# Altium schematic sheet MainBOB (RUDR).SchDoc
size C; SheetNumber: 1; SheetTotal: 3
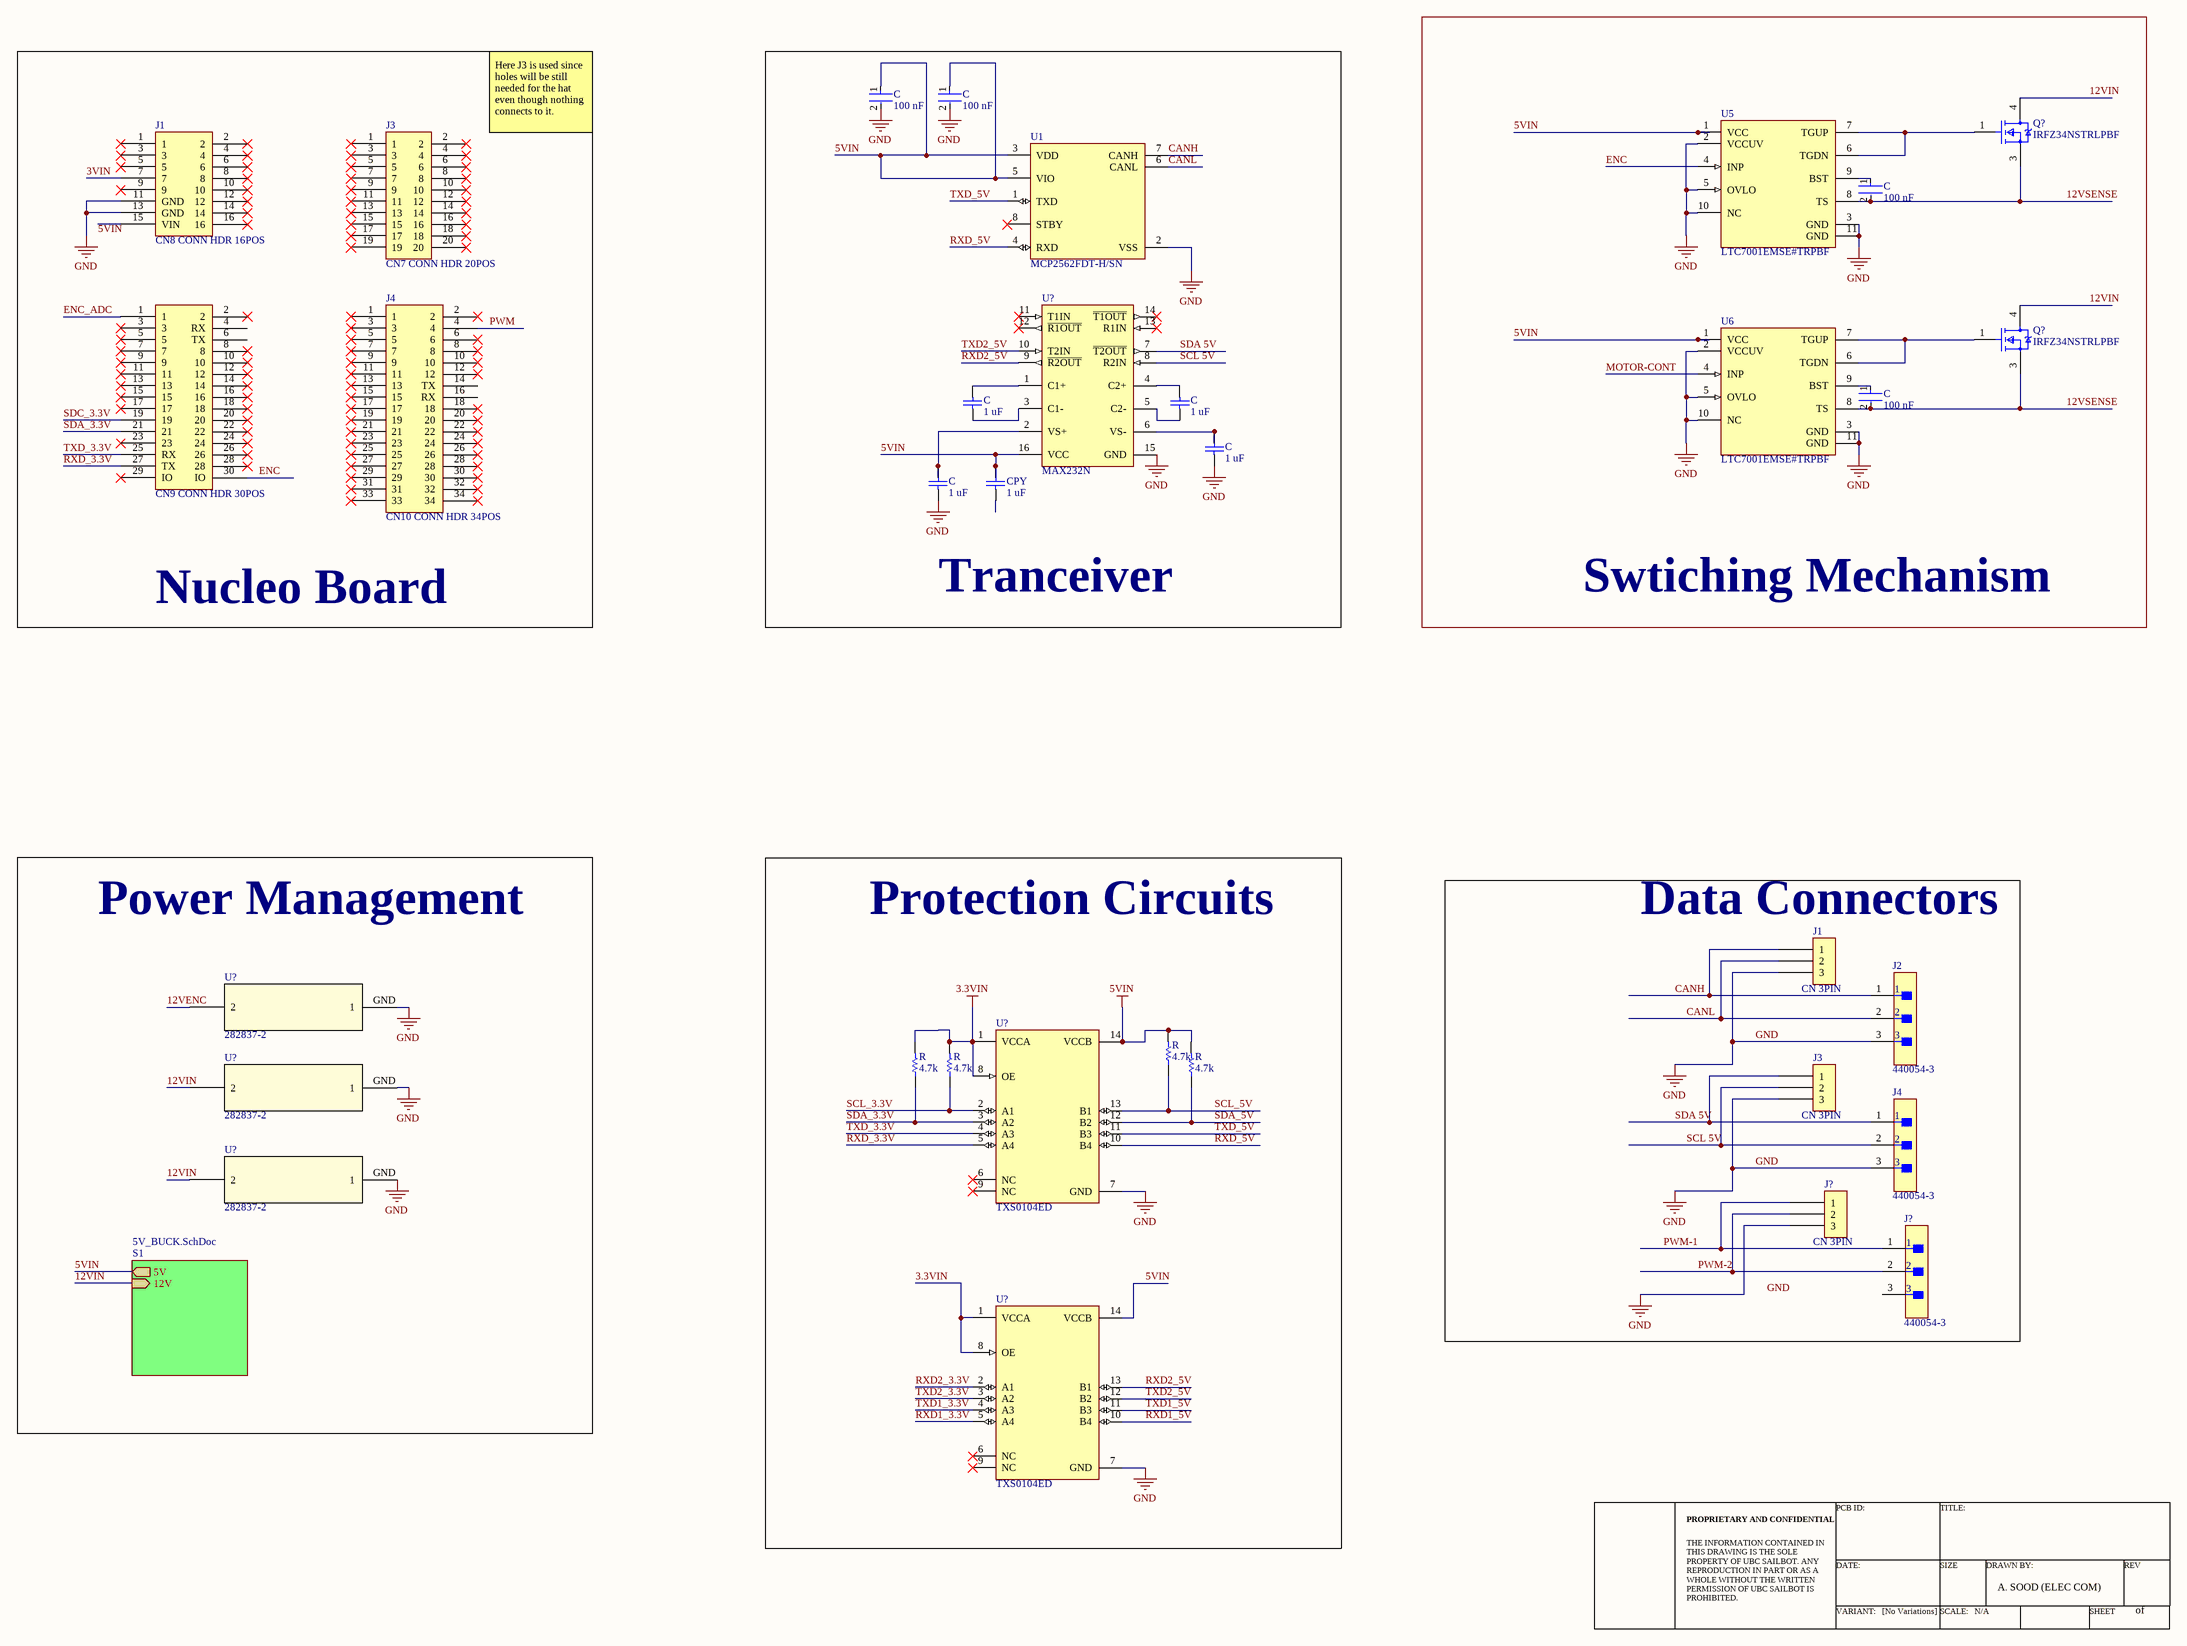
[diagram p0: MainBOB (RUDR).SchDoc]

## Parts
(Parts that share a designator on the sheet are numbered #1, #2 ... from top to bottom, then left to right.)
*  Title Block  (value not drawn)
C#1  100 nF  [FP-0805-L_2_01_0_2-W_1_25-IPC_B]
C#2  100 nF  [FP-0805-L_2_01_0_2-W_1_25-IPC_B]
C#3  100 nF  [FP-0805-L_2_01_0_2-W_1_25-IPC_B]
C#4  100 nF  [FP-0805-L_2_01_0_2-W_1_25-IPC_B]
C#5  1 uF  [CAPC2013X140X50LL20T25]
C#6  1 uF  [CAPC2013X140X50LL20T25]
C#7  1 uF  [CAPC2013X140X50LL20T25]
C#8  1 uF  [CAPC2013X140X50LL20T25]
CPY  1 uF  [CAPC2013X140X50LL20T25]
J1#1  CN8 CONN HDR 16POS  [CN8_8X2_PADS]
J1#2  CN 3PIN  [3X1 CON]
J2  440054-3  [FP-440054-3-MFG]
J3#1  CN7 CONN HDR 20POS  [CN7_10X2_PADS]
J3#2  CN 3PIN  [3X1 CON]
J4#1  CN10 CONN HDR 34POS  [CN10_17X2_PADS]
J4#2  440054-3  [FP-440054-3-MFG]
J?#1  CN9 CONN HDR 30POS  [CN9_15X2_PADS]
J?#2  CN 3PIN  [3X1 CON]
J?#3  440054-3  [FP-440054-3-MFG]
Q?#1  IRFZ34NSTRLPBF  [FP-PG-TO263-3-MFG]
Q?#2  IRFZ34NSTRLPBF  [FP-PG-TO263-3-MFG]
R#1  4.7k  [YAGO-RC0805_M]
R#2  4.7k  [YAGO-RC0805_M]
R#3  4.7k  [YAGO-RC0805_M]
R#4  4.7k  [YAGO-RC0805_M]
U1  MCP2562FDT-H/SN  [FP-C04-057-SN-IPC_A]
U5  LTC7001EMSE#TRPBF  [FP-MSE-10-05-08-1664-IPC_A]
U6  LTC7001EMSE#TRPBF  [FP-MSE-10-05-08-1664-IPC_A]
U?#1  MAX232N  [N0016A]
U?#2  282837-2  [282837-2_TYC]
U?#3  TXS0104ED  [FP-D0014A-MFG]
U?#4  282837-2  [282837-2_TYC]
U?#5  282837-2  [282837-2_TYC]
U?#6  TXS0104ED  [FP-D0014A-MFG]

## Blocks framed on the sheet
Swtiching Mechanism: C#3 C#4 Q?#1 Q?#2 U5 U6
Nucleo Board: J1#1 J3#1 J4#1 J?#1
Tranceiver: C#1 C#2 C#5-C#8 CPY U1 U?#1
Power Management: U?#2 U?#4 U?#5
Protection Circuits: R#1-R#4 U?#3 U?#6
Data Connectors: J1#2 J2 J3#2 J4#2 J?#2 J?#3

## Sub-sheets
S1 = 5V_BUCK.SchDoc: 5V (out), 12V (in)

## Nets
3.3VIN: R#2.2 R#3.2 U?#3.1(VCCA) U?#3.8(OE) U?#6.1(VCCA) U?#6.8(OE)
5VIN: C#1.1 C#2.1 CPY.2 R#1.2 R#4.2 U1.3(VDD) U1.5(VIO) U5.1(VCC) U6.1(VCC) U?#1.16(VCC) U?#3.14(VCCB) U?#6.14(VCCB) ; sheet S1/5V
GND: C#1.2 C#2.2 C#7.1 C#8.1 J1#1.11(GND) J1#1.13(GND) J1#2.3 J2.3 J3#2.3 J4#2.3 J?#2.3 U1.2(VSS) U5.2(VCCUV) U5.3(GND) U5.5(OVLO) U5.10(NC) U5.11(GND) U6.2(VCCUV) U6.3(GND) U6.5(OVLO) U6.10(NC) U6.11(GND) U?#1.15(GND) U?#2.GND(1) U?#3.7(GND) U?#4.GND(1) U?#5.GND(1) U?#6.7(GND)
3VIN: J1#1.7
12VENC: U?#2.12VIN(2)
12VIN: Q?#1.4(D) Q?#2.4(D) U?#4.12VIN(2) U?#5.12VIN(2) ; sheet S1/12V
12VSENSE: C#3.2 C#4.2 Q?#1.3(S) Q?#2.3(S) U5.8(TS) U6.8(TS)
CANH: J1#2.1 J2.1 U1.7(CANH)
CANL: J1#2.2 J2.2 U1.6(CANL)
ENC: J?#1.30(IO) U5.4(INP)
ENC_ADC: J?#1.1
MOTOR-CONT: U6.4(INP)
PWM: J4#1.4
PWM-1: J?#2.1 J?#3.1
PWM-2: J?#2.2 J?#3.2
RXD1_3.3V: U?#6.5(A4)
RXD1_5V: U?#6.10(B4)
RXD2_3.3V: U?#6.2(A1)
RXD2_5V: U?#1.9(~{R2OUT}) U?#6.13(B1)
RXD_3.3V: J?#1.27(TX) U?#3.5(A4)
RXD_5V: U1.4(RXD) U?#3.10(B4)
SCL 5V: J3#2.2 J4#2.2 U?#1.8(R2IN)
SCL_3.3V: R#3.1 U?#3.2(A1)
SCL_5V: R#1.1 U?#3.13(B1)
SDA 5V: J3#2.1 J4#2.1 U?#1.7(~{T2OUT})
SDA_3.3V: J?#1.21 R#2.1 U?#3.3(A2)
SDA_5V: R#4.1 U?#3.12(B2)
SDC_3.3V: J?#1.19
TXD1_3.3V: U?#6.4(A3)
TXD1_5V: U?#6.11(B3)
TXD2_3.3V: U?#6.3(A2)
TXD2_5V: U?#1.10(T2IN) U?#6.12(B2)
TXD_3.3V: J?#1.25(RX) U?#3.4(A3)
TXD_5V: U1.1(TXD) U?#3.11(B3)
NetC#3_1: C#3.1 U5.9(BST)
NetC#4_1: C#4.1 U6.9(BST)
NetC#5_1: C#5.1 U?#1.3(C1-)
NetC#5_2: C#5.2 U?#1.1(C1+)
NetC#6_1: C#6.1 U?#1.5(C2-)
NetC#6_2: C#6.2 U?#1.4(C2+)
NetC#7_2: C#7.2 U?#1.6(VS-)
NetC#8_2: C#8.2 U?#1.2(VS+)
NetQ?#1_1: Q?#1.1(G) U5.6(TGDN) U5.7(TGUP)
NetQ?#2_1: Q?#2.1(G) U6.6(TGDN) U6.7(TGUP)

Not connected (* = marked no-connect by the designer): CPY 1; J1#1 1* 2* 3* 4* 5* 6* 8* 9* 10* 12* 14* 15(VIN) 16*; J3#1 1* 2* 3* 4* 5* 6* 7* 8* 9* 10* 11* 12* 13* 14* 15* 16* 17* 18* 19* 20*; J4#1 1* 2* 3* 5* 6* 7* 8* 9* 10* 11* 12* 13* 14(TX) 15* 16(RX) 17* 18* 19* 20* 21* 22* 23* 24* 25* 26* 27* 28* 29* 30* 31* 32* 33* 34*; J?#1 2* 3* 4(RX) 5* 6(TX) 7* 8* 9* 10* 11* 12* 13* 14* 15* 16* 17* 18* 20* 22* 23* 24* 26* 28* 29(IO)*; J?#3 3; U1 8(STBY)*; U?#1 11(T1IN)* 12(~{R1OUT})* 13(R1IN)* 14(~{T1OUT})*; U?#3 6(NC)* 9(NC)*; U?#6 6(NC)* 9(NC)*

## Notes on the sheet
- Here J3 is used since holes will be still needed for the hat even though nothing connects to it.
- C
- of
- Labels drawn without touching a wire or pin: 5VIN, GND
- (in symbol Title Block) PCB ID:; TITLE:; PROPRIETARY AND CONFIDENTIAL; DATE:; SIZE; DRAWN BY:; REV; A. SOOD (ELEC COM); A; THE INFORMATION CONTAINED IN THIS DRAWING IS THE SOLE PROPERTY OF UBC SAILBOT. ANY REPRODUCTION IN PART OR AS A WHOLE WITHOUT THE WRITTEN PERMISSION OF UBC SAILBOT IS PROHIBITED.; VARIANT:   [No Variations]; SCALE:   N/A; SHEET

## Library data of the parts
C#1-C#4 = CMP-2007-04172-2: Automotive Ceramic Capacitor, 0805, 100nF, 10%, X7R, 15%, 100V; Voltage Rating (DC): 100V; Case Code (Metric): 2012; Mount: Surface Mount; Length: 2.01mm; Depth: 1.25mm; Lead Free: Lead Free; Ratings: AEC-Q200; Max Operating Temperature: 125°C; Tolerance: 10%; Case/Package: 0805; Width: 0.049inch; Package Quantity: 1; Thickness: 0.055inch; Construction: Flat; Min Operating Temperature: -55°C; REACH SVHC: No SVHC; Number of Pins: 2; Radiation Hardening: No; Capacitance: 100nF; Voltage Rating: 100V; Height: 1.4mm; Series: -; Voltage: 100V; Dielectric: X7R; Termination: SMD/SMT; Case Code (Imperial): 0805; RoHS Compliant: Yes; Packaging: Tape and Reel; Dielectric Material: Ceramic
C#5-C#8 CPY = CMP-2007-03234-1: Part Number: C0805C105K3RACTU; Manufacturer: Kemet
J1#1 = CN8 CONN HDR 16POS: CN8 CONN HDR 16POS 0.1 STACK
J2 J4#2 J?#3 = CMP-03369-000008-1: CONN HEADER VERT 3POS 2MM; Manufacturer: TE Connectivity; Voltage Rating: 250V; Number Of Contacts: 3; Conn Gender: Male; Conn Orientation: Vertical; Current Rating: 3A; Octopart: https://octopart.com/440054-3-te+connectivity-40394845; Device Class L3: unset; Device Class L1: Connectors; Number Of Rows: 1; Temperature: -25°C to +105°C; Temperature Range Low: -25°C; Automotive: No; Package: 0; Manufacturer Part Number: 440054-3; ComponentLink2URL: https://www.te.com/usa-en/product-440054-3.datasheet.pdf; Device Class L2: Headers and Wire Housings; Temperature Range High: +105°C; Digikey Description: CONN HEADER VERT 3POS 2MM; Contact Material: Tin,Nickel; Footprint Url: https://www.te.com/commerce/DocumentDelivery/DDEController?Action=showdoc&DocId=Customer+Drawing%7F440054%7FF6%7Fpdf%7FEnglish%7FENG_CD_440054_F6.pdf%7F440054-3; RoHS: TRUE; ComponentLink2Description: Datasheet; Mouser Description: Headers & Wire Housings 3 POS HDR VERT 2.0mm; Lead Free: Yes; Category: Conn; Height: 6.35mm; Pitch: 2mm
J3#1 = CN7 CONN HDR 20POS: CN7 CONN HDR 20 POS  0.1 STACK
J4#1 = CN10 CONN HDR 34POS: CN10 CONN HDR 34 POS  0.1 STACK
J?#1 = CN9 CONN HDR 30POS: CN9 CONN HDR 30 POS  0.1 STACK
Q?#1 Q?#2 = CMP-32901-000301-1: MOSFET N-CH 55V 29A D2PAK; Drain to Source Resistance: 40mR; Input Capacitance: 700pF; Power Dissipation: 68W; Turn-On Delay Time: 7ns; Turn-Off Delay Time: 31ns; Max Power Dissipation: 3.8W; Length: 0.42inch; Case/Package: D2PAK; Min Operating Temperature: -55°C; Max Dual Supply Voltage: 55V; Continuous Drain Current (ID): 29A; Packaging: Tape and Reel; Halogen Free: Halogen Free; Number of Pins: 3; Mount: Surface Mount; Lead Free: Contains Lead; Rds On Max: 40mR; RoHS Compliant: Yes; Drain to Source Voltage (Vdss): 55V; Max Operating Temperature: 175°C
R#1-R#4 = CMP-1568-00001-1: General Puprose Chip Resistor, 4700 Ohm +/- 1%, 0.125 W, -55 to 155 degC, 2-Pin SMD, RoHS, Tape and Reel; PartNumber: RC0805FR-074K7L; Tolerance: +/- 1%; Power: 0.125 W; PackageDescription: 2-Pin Surface Mount Device, Body 2 x 1.25 mm; ComponentLink2URL: http://www.yageo.com/documents/recent/PYu-RC_Group_51_RoHS_L-3.pdf; Temperature Min: -55 degC; Packing: Tape and Reel; Mounting Technology: Surface Mount; ComponentLink1URL: http://www.yageo.com/NewPortal/_en/index.jsp; Resistance: 4700 Ohm; Temperature Max: 155 degC; ComponentLink2Description: Datasheet; DatasheetVersion: Rev. 3; RoHS: TRUE; ComponentLink1Description: Manufacturer URL
U1 = CMP-06279-000047-1: IC TRANSCEIVER 1/1 8SOIC; Operating Supply Current: 70mA; Receiver Hysteresis: 200mV; Max Supply Voltage: 5.5V; Number of Transceivers: 1; Min Supply Voltage: 4.5V; Data Rate: 8Mbps; Case/Package: SOIC; Weight: 0.019048oz; Package Quantity: 3300; Max Operating Temperature: 150°C; Packaging: Tape and Reel; RoHS Compliant: Yes; Series: -; Number of Pins: 8; Min Operating Temperature: -40°C; Mount: Surface Mount
U5 U6 = CMP-09133-000017-1: IC GATE DRVR HIGH-SIDE 10MSOP; RoHS Compliant: Yes
U?#1 = CMP-0299-00084-2: Dual EIA-232 Driver / Receiver, 0 to 70 degC, 16-Pin PDIP (N), Pb-Free (RoHS); Single Supply: TRUE; ICC(Max)(mA): 10; SubFamily: RS-232; Supply Voltage(s)(V): 5; ESD HBM(kV): +/-2; Receivers Per Package: 2; ComponentLink1Description: Manufacturer URL; PackageDescription: 16-Pin Plastic Dual-In-Line Package, Row Spacing 7.62 mm, Pitch 2.54 mm; ComponentLink3Description: Package Specification; DatasheetVersion: SLLS047L; ComponentLink2URL: http://www.ti.com/general/docs/lit/getliterature.tsp?genericPartNumber=MAX232&fileType=pdf; RS-232: TRUE; ComponentLink3URL: http://www.ti.com/litv/pdf/mpdi002c; PackageReference: N0016A; PackageVersion: revE, Dec-2002; ComponentLink1URL: www.ti.com; Drivers Per Package: 2; ComponentLink2Description: Datasheet
U?#2 U?#4 U?#5 = 282837-2: No Description Available; Mfr_Name: TE Connectivity; RefDes: RefDes; Type: Type
U?#3 U?#6 = CMP-04899-000005-1: IC TRNSLTR BIDIRECTIONAL 14SOIC; Manufacturer: Texas Instruments; Min Supply Voltage: 1.65V; V A Min: 1.25V; Standoff Height: 0.1mm; Max Junction Temp: +150°C; Nominal Supply Current: 14.4uA; Data Rate: 24Mbits/s; Number Of Outputs: 4; V B Max: 4.4V; V B Min: 0.4V; Propagation Delay: 165ns; Number Of Circuits: 1; Max Supply Voltage: 5.5V; V A Max: 3.6V; Logic Function Desc: Non-Inverting; Ambient Temperature Range High: +85°C; Category: IC; Device Class L1: Integrated Circuits (ICs); Ambient Temperature Range Low: -40°C; Height: 1.75mm; Digikey Description: IC TRNSLTR BIDIRECTIONAL 14SOIC; Device Class L2: Logic ICs; Automotive: No; Mouser Description: 4-Bit Bidirectional Voltage-Level Shifter for Open-Drain and Push-Pull Applications 14-SOIC -40 to 85; Lead Free: Yes; Temperature Range High: +85°C; ComponentLink2URL: http://www.ti.com/lit/ds/symlink/txs0104e.pdf; ComponentLink2Description: Datasheet; Manufacturer Part Number: TXS0104ED; Device Class L3: Voltage Level Shifters; RoHS: TRUE; Temperature: -40°C to +85°C; Package: D0014A; Number Of Inputs: 4; Temperature Range Low: -40°C; Octopart: https://octopart.com/txs0104ed-texas+instruments-1486620